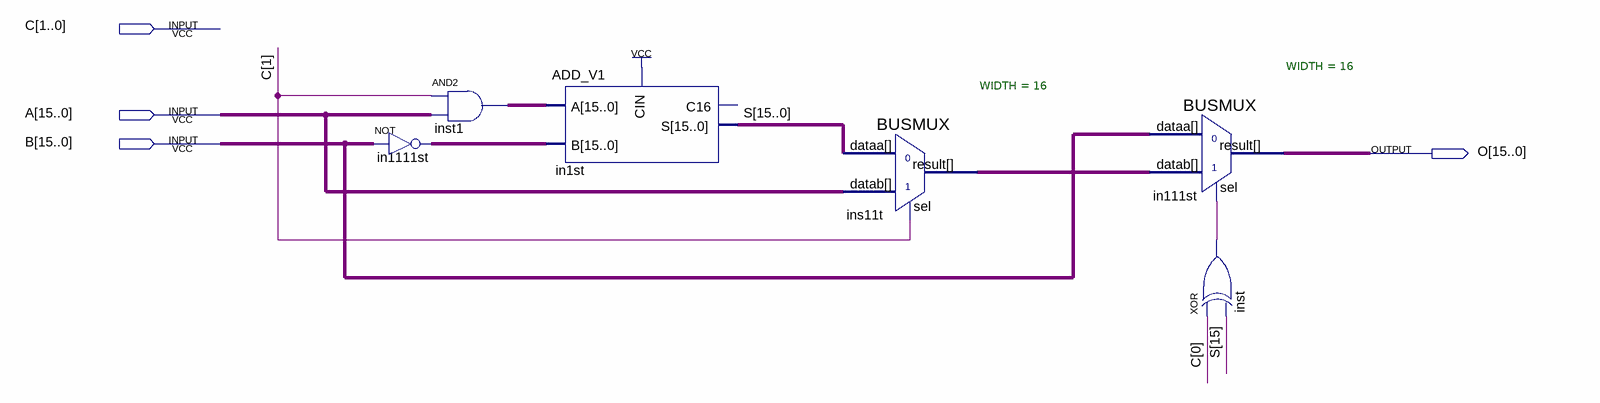
[diagram p0: schematic sheet]
// Quartus schematic ABSMINMAX.bdf as structural Verilog: 6 symbols, 4 pins
module ABSMINMAX (
  input  [1:0] C,
  input  [15:0] A,
  input  [15:0] B,
  output [15:0] O
);

  wire inst_out;
  wire [15:0] in1111st_out, ins11t_result, inst1_out, S;

  assign in1111st_out = ~B;  // NOT in1111st, 16 bits wide
  assign inst1_out = {16{C[1]}} & A;  // AND2 inst1, 16 bits wide
  ADD_V1 in1st (.A(inst1_out), .B(in1111st_out), .CIN(1'b1), .S(S));  // open: C16
  BUSMUX #(.WIDTH(16)) ins11t (.datab(A), .sel(C[1]), .dataa(S), .result(ins11t_result));
  BUSMUX #(.WIDTH(16)) in111st (.datab(ins11t_result), .sel(inst_out), .dataa(B), .result(O));
  xor inst (inst_out, C[0], S[15]);
endmodule
